# EasyEDA schematic claude-micro-easyeda.json
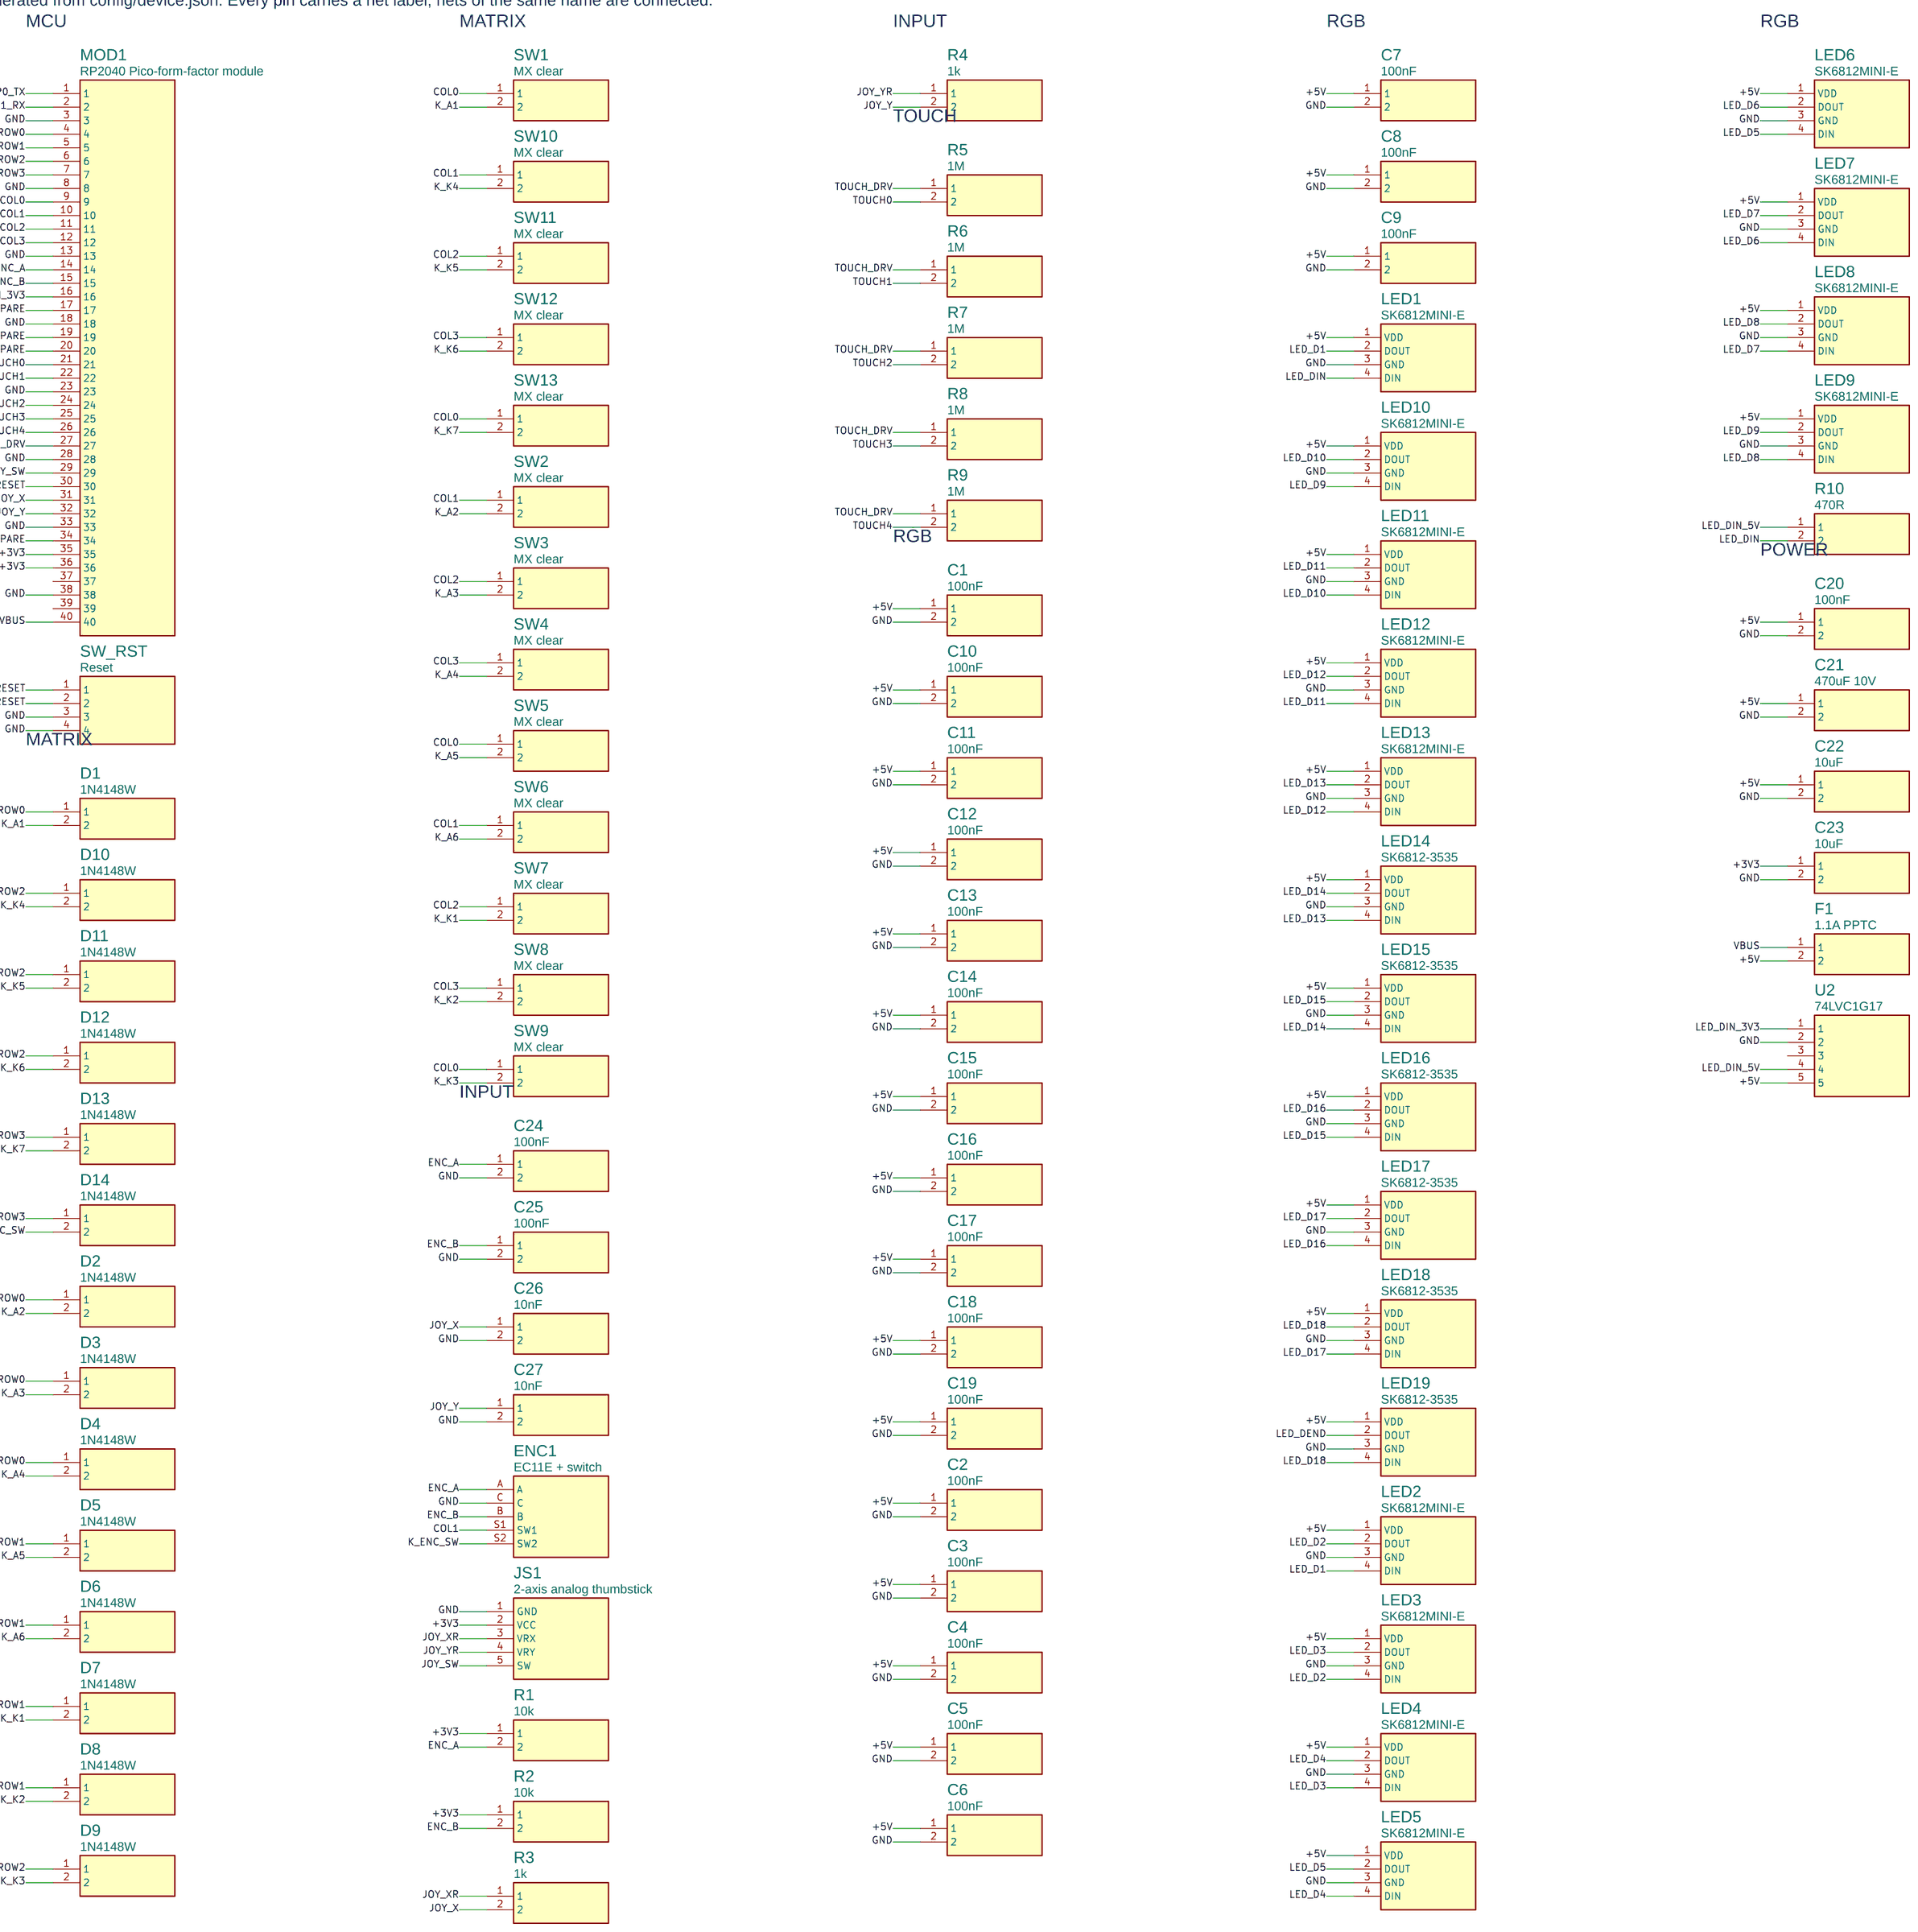
[diagram p0: schematic sheet]

## Parts
C1  100nF  [C_0603]
C2  100nF  [C_0603]
C3  100nF  [C_0603]
C4  100nF  [C_0603]
C5  100nF  [C_0603]
C6  100nF  [C_0603]
C7  100nF  [C_0603]
C8  100nF  [C_0603]
C9  100nF  [C_0603]
C10  100nF  [C_0603]
C11  100nF  [C_0603]
C12  100nF  [C_0603]
C13  100nF  [C_0603]
C14  100nF  [C_0603]
C15  100nF  [C_0603]
C16  100nF  [C_0603]
C17  100nF  [C_0603]
C18  100nF  [C_0603]
C19  100nF  [C_0603]
C20  100nF  [C_0603]
C21  470uF 10V  [C_1210_BULK]
C22  10uF  [C_0805]
C23  10uF  [C_0805]
C24  100nF  [C_0603]
C25  100nF  [C_0603]
C26  10nF  [C_0603]
C27  10nF  [C_0603]
D1  1N4148W  [D_SOD123]
D2  1N4148W  [D_SOD123]
D3  1N4148W  [D_SOD123]
D4  1N4148W  [D_SOD123]
D5  1N4148W  [D_SOD123]
D6  1N4148W  [D_SOD123]
D7  1N4148W  [D_SOD123]
D8  1N4148W  [D_SOD123]
D9  1N4148W  [D_SOD123]
D10  1N4148W  [D_SOD123]
D11  1N4148W  [D_SOD123]
D12  1N4148W  [D_SOD123]
D13  1N4148W  [D_SOD123]
D14  1N4148W  [D_SOD123]
ENC1  EC11E + switch  [EC11E]
F1  1.1A PPTC  [F_1206]
JS1  2-axis analog thumbstick  [Joystick_20mm]
LED1  SK6812MINI-E  [SK6812MINI]
LED2  SK6812MINI-E  [SK6812MINI]
LED3  SK6812MINI-E  [SK6812MINI]
LED4  SK6812MINI-E  [SK6812MINI]
LED5  SK6812MINI-E  [SK6812MINI]
LED6  SK6812MINI-E  [SK6812MINI]
LED7  SK6812MINI-E  [SK6812MINI]
LED8  SK6812MINI-E  [SK6812MINI]
LED9  SK6812MINI-E  [SK6812MINI]
LED10  SK6812MINI-E  [SK6812MINI]
LED11  SK6812MINI-E  [SK6812MINI]
LED12  SK6812MINI-E  [SK6812MINI]
LED13  SK6812MINI-E  [SK6812MINI]
LED14  SK6812-3535  [SK6812_3535]
LED15  SK6812-3535  [SK6812_3535]
LED16  SK6812-3535  [SK6812_3535]
LED17  SK6812-3535  [SK6812_3535]
LED18  SK6812-3535  [SK6812_3535]
LED19  SK6812-3535  [SK6812_3535]
MOD1  RP2040 Pico-form-factor module  [RP2040_Module_Pico]
R1  10k  [R_0603]
R2  10k  [R_0603]
R3  1k  [R_0603]
R4  1k  [R_0603]
R5  1M  [R_0603]
R6  1M  [R_0603]
R7  1M  [R_0603]
R8  1M  [R_0603]
R9  1M  [R_0603]
R10  470R  [R_0603]
SW1  MX clear  [MX_PCB]
SW2  MX clear  [MX_PCB]
SW3  MX clear  [MX_PCB]
SW4  MX clear  [MX_PCB]
SW5  MX clear  [MX_PCB]
SW6  MX clear  [MX_PCB]
SW7  MX clear  [MX_PCB]
SW8  MX clear  [MX_PCB]
SW9  MX clear  [MX_PCB]
SW10  MX clear  [MX_PCB]
SW11  MX clear  [MX_PCB]
SW12  MX clear  [MX_PCB]
SW13  MX clear  [MX_PCB]
SW_RST  Reset  [SW_Push_6mm]
U2  74LVC1G17  [SOT-23-5]

## Library data of the parts
C1-C20 C24 C25 = 100nF
C21 = 470uF 10V: Manufacturer Part: Low-ESR bulk
C22 C23 = 10uF
C26 C27 = 10nF
D1-D14 = 1N4148W: Manufacturer Part: 1N4148W SOD-123
ENC1 = EC11E + switch: Manufacturer Part: EC11E15244Ax (9 mm shaft)
F1 = 1.1A PPTC: Manufacturer Part: MF-MSMF110
JS1 = 2-axis analog thumbstick: Manufacturer Part: 20 mm planar thumbstick, 10k pots
LED1-LED13 = SK6812MINI-E
LED14-LED19 = SK6812-3535
MOD1 = RP2040 Pico-form-factor module: Manufacturer Part: YD-RP2040 / RP2040-Plus / Raspberry Pi Pico
R1 R2 = 10k
R3 R4 = 1k
R5-R9 = 1M
R10 = 470R
SW1-SW13 = MX clear: Manufacturer Part: MX-compatible, clear housing, 5-pin
SW_RST = Reset
U2 = 74LVC1G17: Manufacturer Part: SN74LVC1G17DBVR

## Nets
+3V3: C23.1 JS1.2(VCC) MOD1.35 MOD1.36 R1.1 R2.1
+5V: C1.1 C2.1 C3.1 C4.1 C5.1 C6.1 C7.1 C8.1 C9.1 C10.1 C11.1 C12.1 C13.1 C14.1 C15.1 C16.1 C17.1 C18.1 C19.1 C20.1 C21.1 C22.1 F1.2 LED1.1(VDD) LED2.1(VDD) LED3.1(VDD) LED4.1(VDD) LED5.1(VDD) LED6.1(VDD) LED7.1(VDD) LED8.1(VDD) LED9.1(VDD) LED10.1(VDD) LED11.1(VDD) LED12.1(VDD) LED13.1(VDD) LED14.1(VDD) LED15.1(VDD) LED16.1(VDD) LED17.1(VDD) LED18.1(VDD) LED19.1(VDD) U2.5
GND: C1.2 C2.2 C3.2 C4.2 C5.2 C6.2 C7.2 C8.2 C9.2 C10.2 C11.2 C12.2 C13.2 C14.2 C15.2 C16.2 C17.2 C18.2 C19.2 C20.2 C21.2 C22.2 C23.2 C24.2 C25.2 C26.2 C27.2 ENC1.C JS1.1(GND) LED1.3(GND) LED2.3(GND) LED3.3(GND) LED4.3(GND) LED5.3(GND) LED6.3(GND) LED7.3(GND) LED8.3(GND) LED9.3(GND) LED10.3(GND) LED11.3(GND) LED12.3(GND) LED13.3(GND) LED14.3(GND) LED15.3(GND) LED16.3(GND) LED17.3(GND) LED18.3(GND) LED19.3(GND) MOD1.3 MOD1.8 MOD1.13 MOD1.18 MOD1.23 MOD1.28 MOD1.33 MOD1.38 SW_RST.3 SW_RST.4 U2.2
VBUS: F1.1 MOD1.40
COL0: MOD1.9 SW1.1 SW5.1 SW9.1 SW13.1
COL1: ENC1.S1(SW1) MOD1.10 SW2.1 SW6.1 SW10.1
COL2: MOD1.11 SW3.1 SW7.1 SW11.1
COL3: MOD1.12 SW4.1 SW8.1 SW12.1
ENC_A: C24.1 ENC1.A MOD1.14 R1.2
ENC_B: C25.1 ENC1.B MOD1.15 R2.2
GP0_TX: MOD1.1
GP1_RX: MOD1.2
GP13_SPARE: MOD1.17
GP14_SPARE: MOD1.19
GP15_SPARE: MOD1.20
GP28_SPARE: MOD1.34
JOY_SW: JS1.5(SW) MOD1.29
JOY_X: C26.1 MOD1.31 R3.2
JOY_XR: JS1.3(VRX) R3.1
JOY_Y: C27.1 MOD1.32 R4.2
JOY_YR: JS1.4(VRY) R4.1
K_A1: D1.2 SW1.2
K_A2: D2.2 SW2.2
K_A3: D3.2 SW3.2
K_A4: D4.2 SW4.2
K_A5: D5.2 SW5.2
K_A6: D6.2 SW6.2
K_ENC_SW: D14.2 ENC1.S2(SW2)
K_K1: D7.2 SW7.2
K_K2: D8.2 SW8.2
K_K3: D9.2 SW9.2
K_K4: D10.2 SW10.2
K_K5: D11.2 SW11.2
K_K6: D12.2 SW12.2
K_K7: D13.2 SW13.2
LED_D1: LED1.2(DOUT) LED2.4(DIN)
LED_D2: LED2.2(DOUT) LED3.4(DIN)
LED_D3: LED3.2(DOUT) LED4.4(DIN)
LED_D4: LED4.2(DOUT) LED5.4(DIN)
LED_D5: LED5.2(DOUT) LED6.4(DIN)
LED_D6: LED6.2(DOUT) LED7.4(DIN)
LED_D7: LED7.2(DOUT) LED8.4(DIN)
LED_D8: LED8.2(DOUT) LED9.4(DIN)
LED_D9: LED9.2(DOUT) LED10.4(DIN)
LED_D10: LED10.2(DOUT) LED11.4(DIN)
LED_D11: LED11.2(DOUT) LED12.4(DIN)
LED_D12: LED12.2(DOUT) LED13.4(DIN)
LED_D13: LED13.2(DOUT) LED14.4(DIN)
LED_D14: LED14.2(DOUT) LED15.4(DIN)
LED_D15: LED15.2(DOUT) LED16.4(DIN)
LED_D16: LED16.2(DOUT) LED17.4(DIN)
LED_D17: LED17.2(DOUT) LED18.4(DIN)
LED_D18: LED18.2(DOUT) LED19.4(DIN)
LED_DEND: LED19.2(DOUT)
LED_DIN: LED1.4(DIN) R10.2
LED_DIN_3V3: MOD1.16 U2.1
LED_DIN_5V: R10.1 U2.4
RESET: MOD1.30 SW_RST.1 SW_RST.2
ROW0: D1.1 D2.1 D3.1 D4.1 MOD1.4
ROW1: D5.1 D6.1 D7.1 D8.1 MOD1.5
ROW2: D9.1 D10.1 D11.1 D12.1 MOD1.6
ROW3: D13.1 D14.1 MOD1.7
TOUCH0: MOD1.21 R5.2
TOUCH1: MOD1.22 R6.2
TOUCH2: MOD1.24 R7.2
TOUCH3: MOD1.25 R8.2
TOUCH4: MOD1.26 R9.2
TOUCH_DRV: MOD1.27 R5.1 R6.1 R7.1 R8.1 R9.1

Not connected (* = marked no-connect by the designer): MOD1 37 39; U2 3

## Notes on the sheet
- Claude Micro  ·  rev 1.0.0
- 13-key agent macropad with rotary reasoning dial, planar joystick, capacitive touch strip and 19-LED RGB chain.
- Generated from config/device.json. Every pin carries a net label; nets of the same name are connected.
- MCU
- MATRIX
- INPUT
- RGB
- RGB
- TOUCH
- RGB
- POWER
- MATRIX
- INPUT
